# EAGLE schematic Regulator_LDO_1117 (EAGLE 6.5.0)
1117 LDO Regulator LD1117 Datasheet <http://www.st.com/web/en/resource/technical/document/datasheet/CD00000544.pdf> LM1117 Datasheet <http://www.ti.com/lit/ds/symlink/lm1117-n.pdf> TLV1117 Datasheet <http://www.ti.com/lit/ds/symlink/tlv1117.pdf> REG1117 Datasheet <http://www.ti.com/lit/ds/symlink/reg1117.pdf> AP1117 Datasheet <http://www.diodes.com/datasheets/AP1117.pdf> ZLDO1117 Datasheet <http://www.diodes.com/datasheets/ZLDO1117.pdf> SPX1117 Datasheet <http://www.exar.com/common/content/document.ashx?id=694> Supports fixed output voltages at 1.2 V, 1.8 V, 2.5 V, 2.85V 3.3 V, 5.0 V Supports output currents between 800mA and 1300mA Supports input voltages up to 15V Max dropout voltages are 1.2V to 1.4V, meaning if using a 3.3V regulator 4.7V or more must be supplied if the dropout is 1.4V
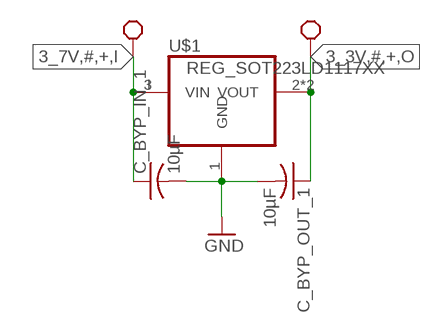
[diagram p0: schematic, sheet 1]

## Parts
C_BYP_IN_1  10µF  C-USC1206  [C1206]
C_BYP_OUT_1  10µF  C-USC0603  [C0603]
U$1  REG_SOT223LD1117XX  [SOT-223]

## Nets
3_3V,#,+,O: C_BYP_OUT_1.1 U$1.2(VOUT) U$1.4(VOUT) ; supply symbol labelled BLOCK_REQUIREMENT
3_7V,#,+,I: C_BYP_IN_1.1 U$1.3(VIN) ; supply symbol labelled BLOCK_REQUIREMENT
GND: C_BYP_IN_1.2 C_BYP_OUT_1.2 U$1.1(GND)

## Library data of the parts
C_BYP_IN_1 C_BYP_OUT_1 = resistor:C-US: CAPACITOR, American symbol
U$1 = piccoli:REG_SOT223